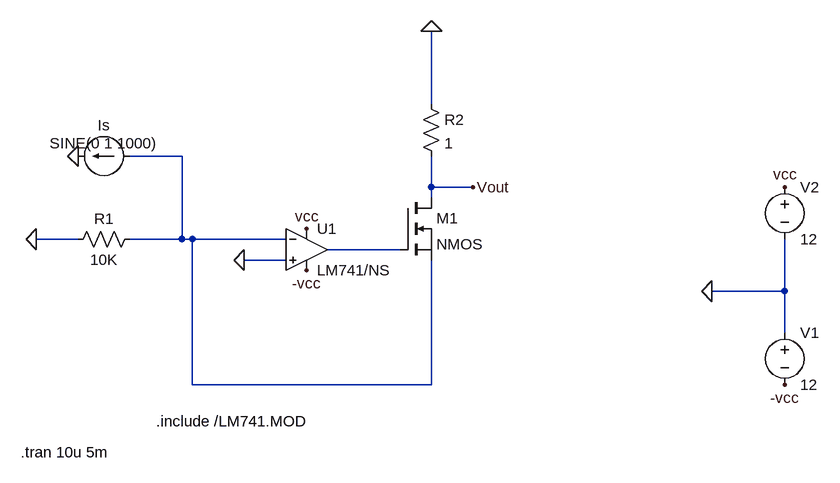
[diagram p0: schematic ee18btech11023.asc]
ee18btech11023.asc, the LTspice schematic file:
Version 4
SHEET 1 1180 680
WIRE 576 -448 576 -560
WIRE 192 -368 112 -368
WIRE 576 -320 576 -368
WIRE 640 -320 576 -320
WIRE 576 -304 576 -320
WIRE 32 -240 -32 -240
WIRE 192 -240 192 -368
WIRE 192 -240 112 -240
WIRE 208 -240 192 -240
WIRE 352 -240 208 -240
WIRE 528 -224 416 -224
WIRE 352 -208 288 -208
WIRE 1120 -160 1120 -240
WIRE 1120 -160 1008 -160
WIRE 1120 -96 1120 -160
WIRE 208 -16 208 -240
WIRE 576 -16 576 -208
WIRE 576 -16 208 -16
FLAG 288 -208 0
FLAG -32 -240 0
FLAG 576 -560 0
FLAG 1120 -320 vcc
FLAG 1120 -16 -vcc
FLAG 384 -192 -vcc
FLAG 384 -256 vcc
FLAG 1008 -160 0
FLAG 32 -368 0
FLAG 640 -320 Vout
SYMBOL Opamps\\opamp2 384 -288 R0
SYMATTR InstName U1
SYMATTR Value LM741/NS
SYMBOL res 128 -256 R90
WINDOW 0 0 56 VBottom 2
WINDOW 3 32 56 VTop 2
SYMATTR InstName R1
SYMATTR Value 10K
SYMBOL voltage 1120 -112 R0
SYMATTR InstName V1
SYMATTR Value 12
SYMBOL voltage 1120 -336 R0
SYMATTR InstName V2
SYMATTR Value 12
SYMBOL current 112 -368 R90
WINDOW 0 -32 40 VBottom 2
WINDOW 3 -4 40 VBottom 2
WINDOW 123 0 0 Left 2
WINDOW 39 0 0 Left 2
SYMATTR InstName Is
SYMATTR Value SINE(0 1 1000)
SYMBOL nmos 528 -304 R0
SYMATTR InstName M1
SYMBOL res 560 -464 R0
SYMATTR InstName R2
SYMATTR Value 1
TEXT 152 40 Left 2 !.include /LM741.MOD
TEXT -56 88 Left 2 !.tran 10u 5m

The netlist it stands for:
* ee18btech11023.asc
XU1 0 N001 vcc -vcc N002 LM741/NS  ; pins In+ In- V+ V- OUT
R1 N001 0 10K
V1 0 -vcc 12
V2 vcc 0 12
Is N001 0 SINE(0 1 1000)
M1 Vout N002 N001 N001 NMOS
R2 0 Vout 1
.model NMOS NMOS
.model PMOS PMOS
.lib standard.mos
.include /LM741.MOD
.tran 10u 5m
.backanno
.end